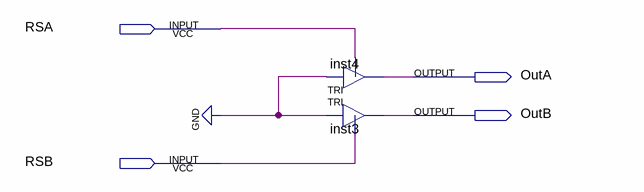
[diagram p0: schematic sheet]
// Quartus schematic Zero.bdf as structural Verilog: 2 symbols, 4 pins
module Zero (
  input  RSA,
  input  RSB,
  output OutA,
  output OutB
);

  TRI inst4 (.IN(1'b0), .OE(RSA), .OUT(OutA));
  TRI inst3 (.IN(1'b0), .OE(RSB), .OUT(OutB));
endmodule
